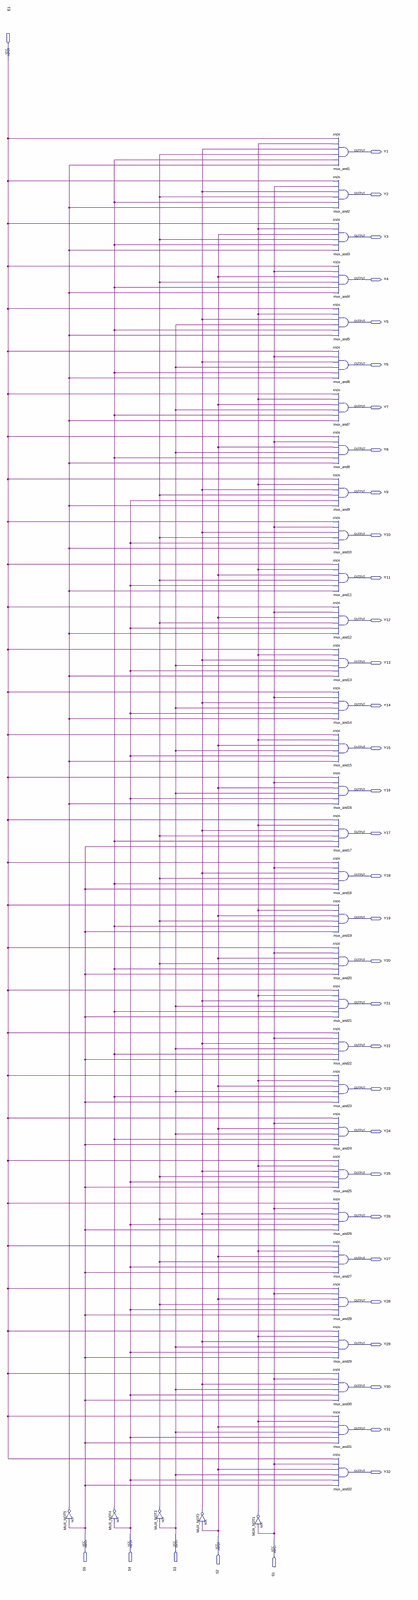
[diagram p0: schematic sheet, whole]
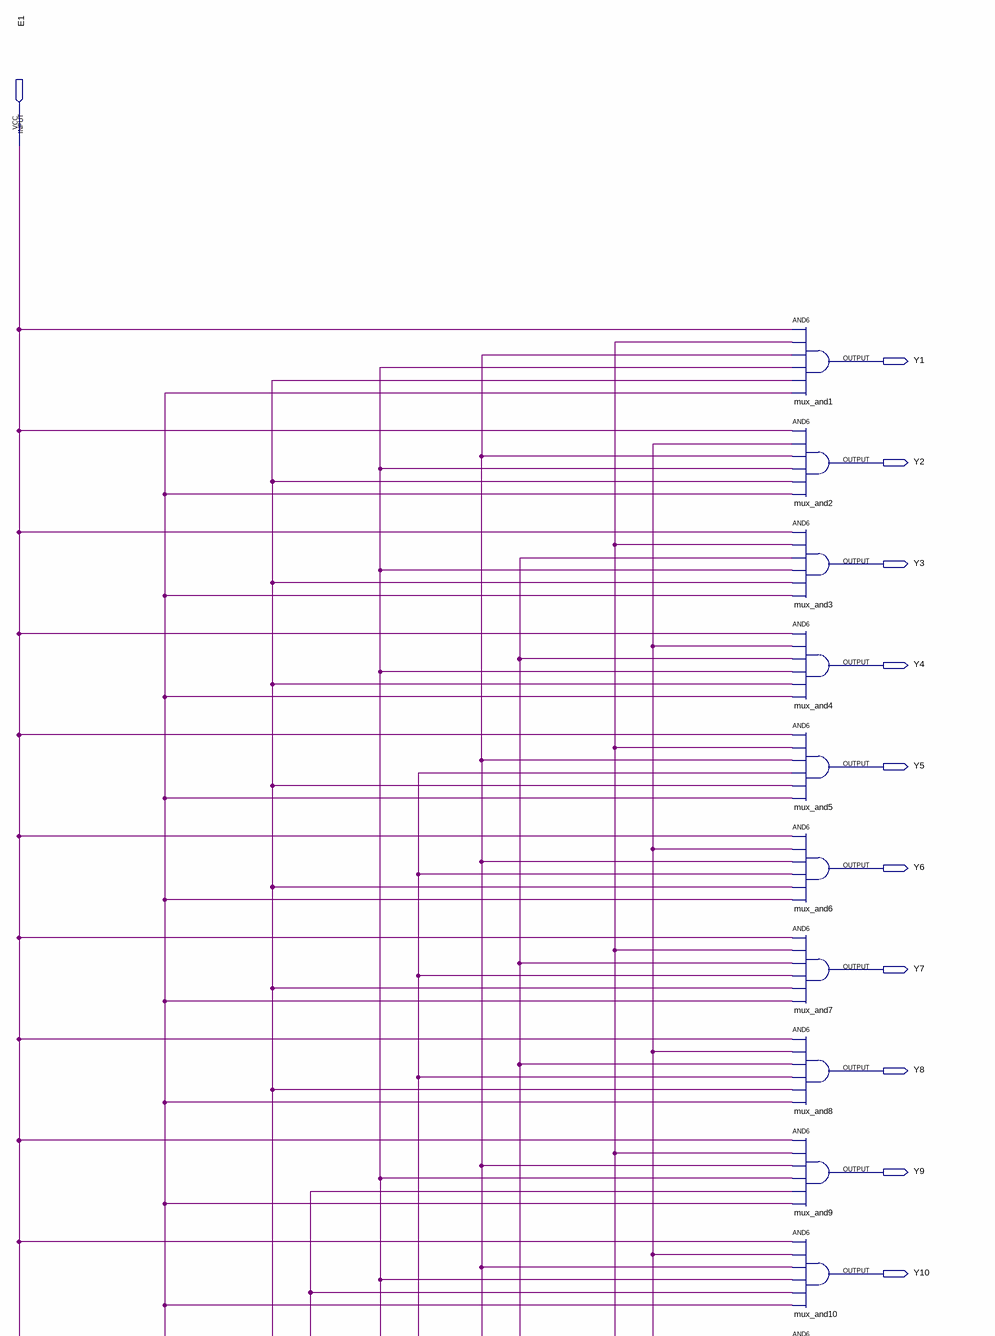
[diagram p1: schematic sheet, upper part]
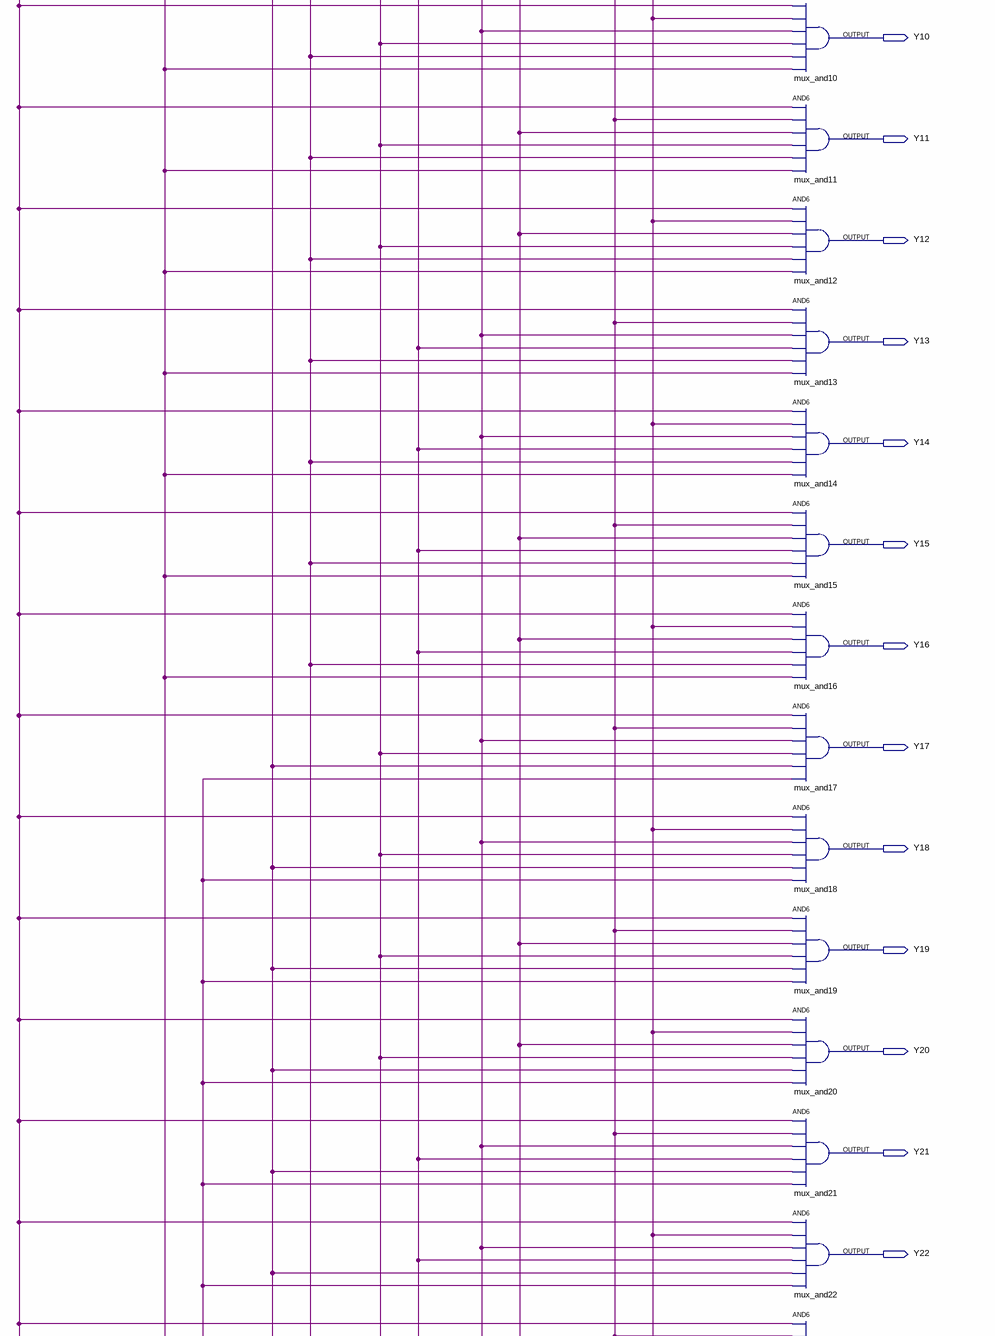
[diagram p2: schematic sheet, middle part]
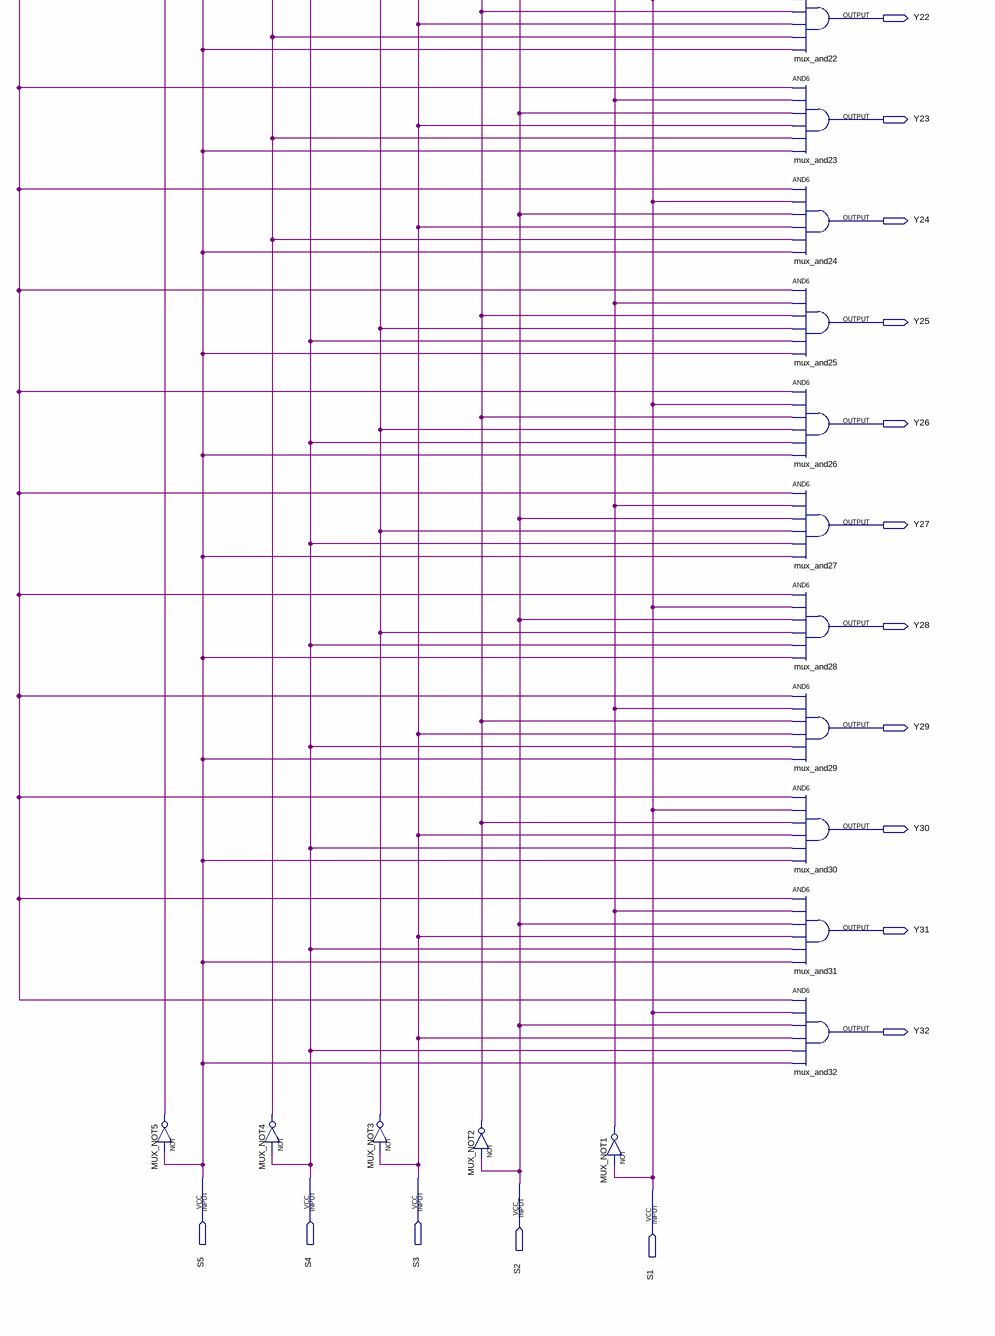
[diagram p3: schematic sheet, lower part]
// Quartus schematic demux32.bdf as structural Verilog: 37 symbols, 38 pins
module demux32 (
  input  E1,
  input  S5,
  input  S4,
  input  S3,
  input  S2,
  input  S1,
  output Y1,
  output Y2,
  output Y3,
  output Y4,
  output Y5,
  output Y6,
  output Y7,
  output Y8,
  output Y9,
  output Y10,
  output Y11,
  output Y12,
  output Y13,
  output Y14,
  output Y15,
  output Y16,
  output Y17,
  output Y18,
  output Y19,
  output Y20,
  output Y21,
  output Y22,
  output Y23,
  output Y24,
  output Y25,
  output Y26,
  output Y27,
  output Y28,
  output Y29,
  output Y30,
  output Y31,
  output Y32
);

  wire MUX_NOT1_out, MUX_NOT2_out, MUX_NOT3_out, MUX_NOT4_out, MUX_NOT5_out;

  not MUX_NOT5 (MUX_NOT5_out, S5);
  not MUX_NOT4 (MUX_NOT4_out, S4);
  not MUX_NOT3 (MUX_NOT3_out, S3);
  not MUX_NOT2 (MUX_NOT2_out, S2);
  not MUX_NOT1 (MUX_NOT1_out, S1);
  and mux_and1 (Y1, E1, MUX_NOT1_out, MUX_NOT2_out, MUX_NOT3_out, MUX_NOT4_out, MUX_NOT5_out);
  and mux_and2 (Y2, E1, S1, MUX_NOT2_out, MUX_NOT3_out, MUX_NOT4_out, MUX_NOT5_out);
  and mux_and3 (Y3, E1, MUX_NOT1_out, S2, MUX_NOT3_out, MUX_NOT4_out, MUX_NOT5_out);
  and mux_and4 (Y4, E1, S1, S2, MUX_NOT3_out, MUX_NOT4_out, MUX_NOT5_out);
  and mux_and5 (Y5, E1, MUX_NOT1_out, MUX_NOT2_out, S3, MUX_NOT4_out, MUX_NOT5_out);
  and mux_and6 (Y6, E1, S1, MUX_NOT2_out, S3, MUX_NOT4_out, MUX_NOT5_out);
  and mux_and7 (Y7, E1, MUX_NOT1_out, S2, S3, MUX_NOT4_out, MUX_NOT5_out);
  and mux_and8 (Y8, E1, S1, S2, S3, MUX_NOT4_out, MUX_NOT5_out);
  and mux_and9 (Y9, E1, MUX_NOT1_out, MUX_NOT2_out, MUX_NOT3_out, S4, MUX_NOT5_out);
  and mux_and10 (Y10, E1, S1, MUX_NOT2_out, MUX_NOT3_out, S4, MUX_NOT5_out);
  and mux_and11 (Y11, E1, MUX_NOT1_out, S2, MUX_NOT3_out, S4, MUX_NOT5_out);
  and mux_and12 (Y12, E1, S1, S2, MUX_NOT3_out, S4, MUX_NOT5_out);
  and mux_and13 (Y13, E1, MUX_NOT1_out, MUX_NOT2_out, S3, S4, MUX_NOT5_out);
  and mux_and14 (Y14, E1, S1, MUX_NOT2_out, S3, S4, MUX_NOT5_out);
  and mux_and15 (Y15, E1, MUX_NOT1_out, S2, S3, S4, MUX_NOT5_out);
  and mux_and16 (Y16, E1, S1, S2, S3, S4, MUX_NOT5_out);
  and mux_and17 (Y17, E1, MUX_NOT1_out, MUX_NOT2_out, MUX_NOT3_out, MUX_NOT4_out, S5);
  and mux_and18 (Y18, E1, S1, MUX_NOT2_out, MUX_NOT3_out, MUX_NOT4_out, S5);
  and mux_and19 (Y19, E1, MUX_NOT1_out, S2, MUX_NOT3_out, MUX_NOT4_out, S5);
  and mux_and20 (Y20, E1, S1, S2, MUX_NOT3_out, MUX_NOT4_out, S5);
  and mux_and21 (Y21, E1, MUX_NOT1_out, MUX_NOT2_out, S3, MUX_NOT4_out, S5);
  and mux_and22 (Y22, E1, S1, MUX_NOT2_out, S3, MUX_NOT4_out, S5);
  and mux_and23 (Y23, E1, MUX_NOT1_out, S2, S3, MUX_NOT4_out, S5);
  and mux_and24 (Y24, E1, S1, S2, S3, MUX_NOT4_out, S5);
  and mux_and25 (Y25, E1, MUX_NOT1_out, MUX_NOT2_out, MUX_NOT3_out, S4, S5);
  and mux_and26 (Y26, E1, S1, MUX_NOT2_out, MUX_NOT3_out, S4, S5);
  and mux_and27 (Y27, E1, MUX_NOT1_out, S2, MUX_NOT3_out, S4, S5);
  and mux_and28 (Y28, E1, S1, S2, MUX_NOT3_out, S4, S5);
  and mux_and29 (Y29, E1, MUX_NOT1_out, MUX_NOT2_out, S3, S4, S5);
  and mux_and30 (Y30, E1, S1, MUX_NOT2_out, S3, S4, S5);
  and mux_and31 (Y31, E1, MUX_NOT1_out, S2, S3, S4, S5);
  and mux_and32 (Y32, E1, S1, S2, S3, S4, S5);
endmodule
